# EAGLE schematic Schaltplan (EAGLE 7.7.0)

## Sheet 1 of 2: SACU
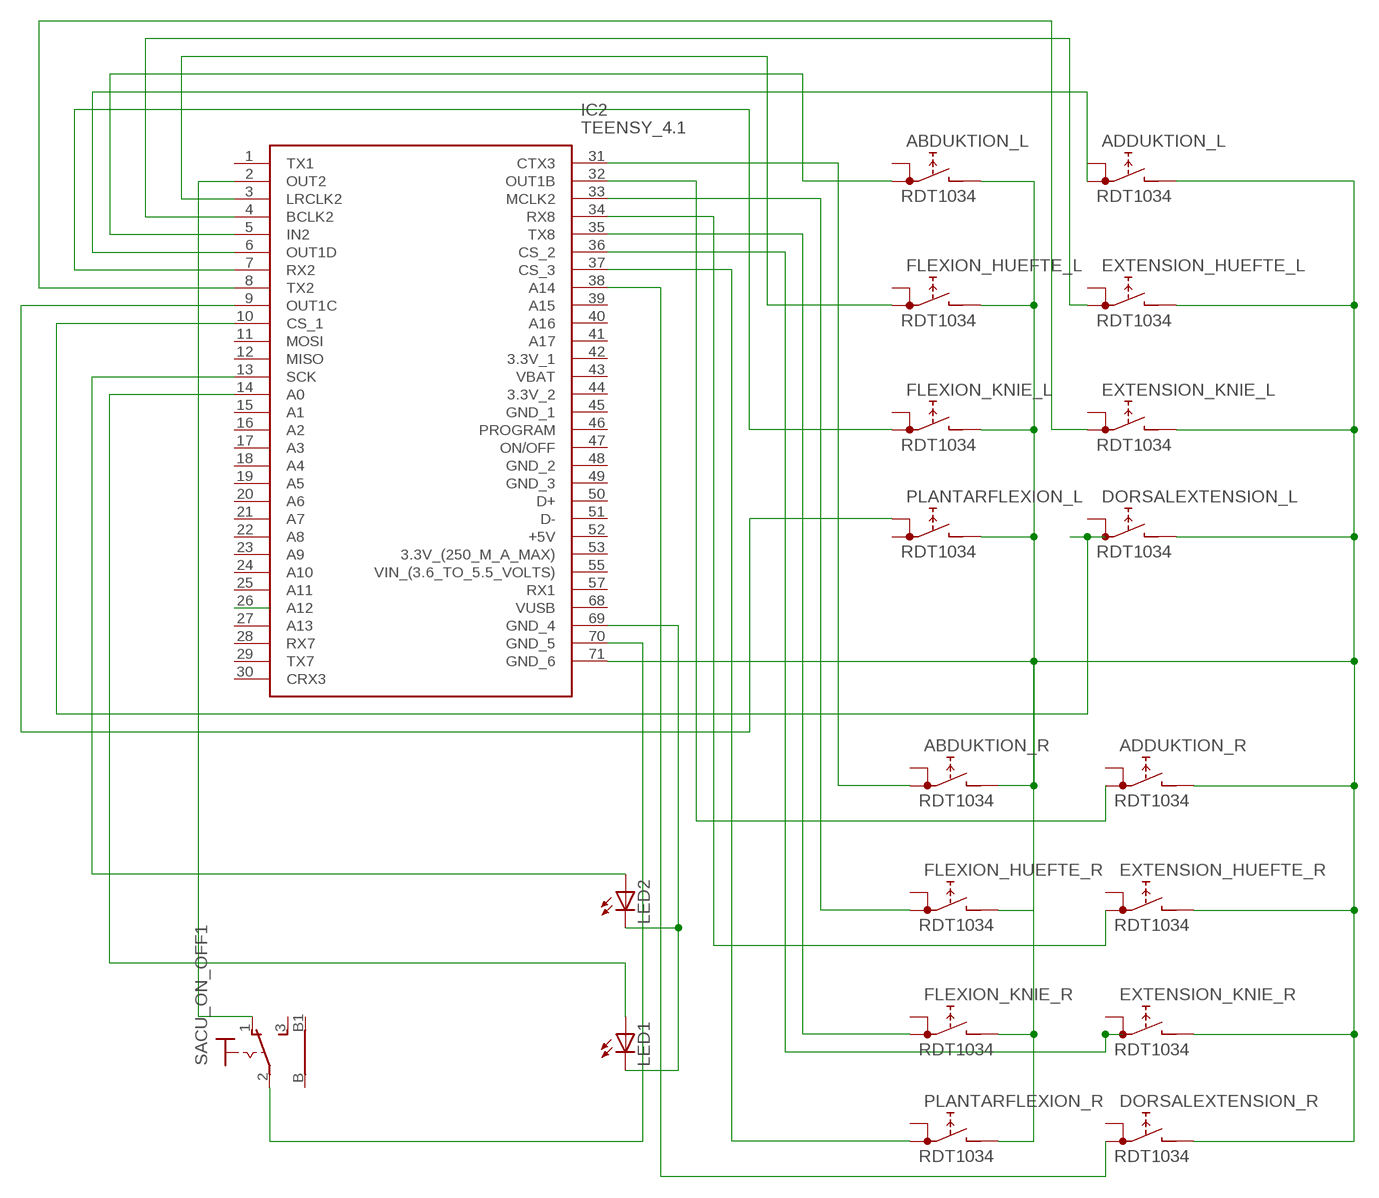
[diagram p0: schematic, sheet 1]

### Parts
ABDUKTION_L  RDT1034  [RDT1034]
ABDUKTION_R  RDT1034  [RDT1034]
ADDUKTION_L  RDT1034  [RDT1034]
ADDUKTION_R  RDT1034  [RDT1034]
DORSALEXTENSION_L  RDT1034  [RDT1034]
DORSALEXTENSION_R  RDT1034  [RDT1034]
EXTENSION_HUEFTE_L  RDT1034  [RDT1034]
EXTENSION_HUEFTE_R  RDT1034  [RDT1034]
EXTENSION_KNIE_L  RDT1034  [RDT1034]
EXTENSION_KNIE_R  RDT1034  [RDT1034]
FLEXION_HUEFTE_L  RDT1034  [RDT1034]
FLEXION_HUEFTE_R  RDT1034  [RDT1034]
FLEXION_KNIE_L  RDT1034  [RDT1034]
FLEXION_KNIE_R  RDT1034  [RDT1034]
IC2  TEENSY_4.1  [TEENSY41]
LED1  LED10MM  [LED10MM]
LED2  LED10MM  [LED10MM]
PLANTARFLEXION_L  RDT1034  [RDT1034]
PLANTARFLEXION_R  RDT1034  [RDT1034]
SACU_ON_OFF1  316-917  [316-917]

### Nets
N$2: ABDUKTION_L.B ABDUKTION_R.B ADDUKTION_L.B ADDUKTION_R.B DORSALEXTENSION_L.B DORSALEXTENSION_R.B EXTENSION_HUEFTE_L.B EXTENSION_HUEFTE_R.B EXTENSION_KNIE_L.B EXTENSION_KNIE_R.B FLEXION_HUEFTE_L.B FLEXION_HUEFTE_R.B FLEXION_KNIE_L.B FLEXION_KNIE_R.B IC2.71(GND_6) PLANTARFLEXION_L.B PLANTARFLEXION_R.B
N$14: IC2.26(A12)
N$15: IC2.2(OUT2) SACU_ON_OFF1.1(O)
N$20: EXTENSION_KNIE_R.A1 IC2.36(CS_2)
N$26: FLEXION_HUEFTE_L.A1 IC2.3(LRCLK2)
N$28: EXTENSION_HUEFTE_L.A1 IC2.4(BCLK2)
N$30: ABDUKTION_L.A1 IC2.5(IN2)
N$31: ADDUKTION_L.A1 IC2.6(OUT1D)
N$32: FLEXION_KNIE_L.A1 IC2.7(RX2)
N$33: EXTENSION_KNIE_L.A1 IC2.8(TX2)
N$34: IC2.9(OUT1C) PLANTARFLEXION_L.A
N$35: IC2.70(GND_5) SACU_ON_OFF1.2(P)
N$36: IC2.13(SCK) LED2.A
N$37: IC2.69(GND_4) LED1.K(C) LED2.K(C)
N$38: ADDUKTION_R.A1 IC2.32(OUT1B)
N$39: IC2.14(A0) LED1.A
N$40: ABDUKTION_R.A1 IC2.31(CTX3)
N$41: FLEXION_HUEFTE_R.A1 IC2.33(MCLK2)
N$42: EXTENSION_HUEFTE_R.A1 IC2.34(RX8)
N$43: FLEXION_KNIE_R.A1 IC2.35(TX8)
N$44: IC2.37(CS_3) PLANTARFLEXION_R.A1
N$45: DORSALEXTENSION_R.A1 IC2.38(A14)
N$46: IC2.10(CS_1)
Unconnected: ABDUKTION_L.A ABDUKTION_R.A ADDUKTION_L.A ADDUKTION_R.A DORSALEXTENSION_L.A DORSALEXTENSION_L.A1 DORSALEXTENSION_R.A EXTENSION_HUEFTE_L.A EXTENSION_HUEFTE_R.A EXTENSION_KNIE_L.A EXTENSION_KNIE_R.A FLEXION_HUEFTE_L.A FLEXION_HUEFTE_R.A FLEXION_KNIE_L.A FLEXION_KNIE_R.A IC2.1(TX1) IC2.11(MOSI) IC2.12(MISO) IC2.15(A1) IC2.16(A2) IC2.17(A3) IC2.18(A4) IC2.19(A5) IC2.20(A6) IC2.21(A7) IC2.22(A8) IC2.23(A9) IC2.24(A10) IC2.25(A11) IC2.27(A13) IC2.28(RX7) IC2.29(TX7) IC2.30(CRX3) IC2.39(A15) IC2.40(A16) IC2.41(A17) IC2.42(3.3V_1) IC2.43(VBAT) IC2.44(3.3V_2) IC2.45(GND_1) IC2.46(PROGRAM) IC2.47(ON/OFF) IC2.48(GND_2) IC2.49(GND_3) IC2.50(D+) IC2.51(D-) IC2.52(+5V) IC2.53(3.3V_(250_M_A_MAX)) IC2.55(VIN_(3.6_TO_5.5_VOLTS)) IC2.57(RX1) IC2.68(VUSB) PLANTARFLEXION_L.A1 PLANTARFLEXION_R.A SACU_ON_OFF1.3(S) SACU_ON_OFF1.B SACU_ON_OFF1.B1

## Sheet 2 of 2: MAIN UI
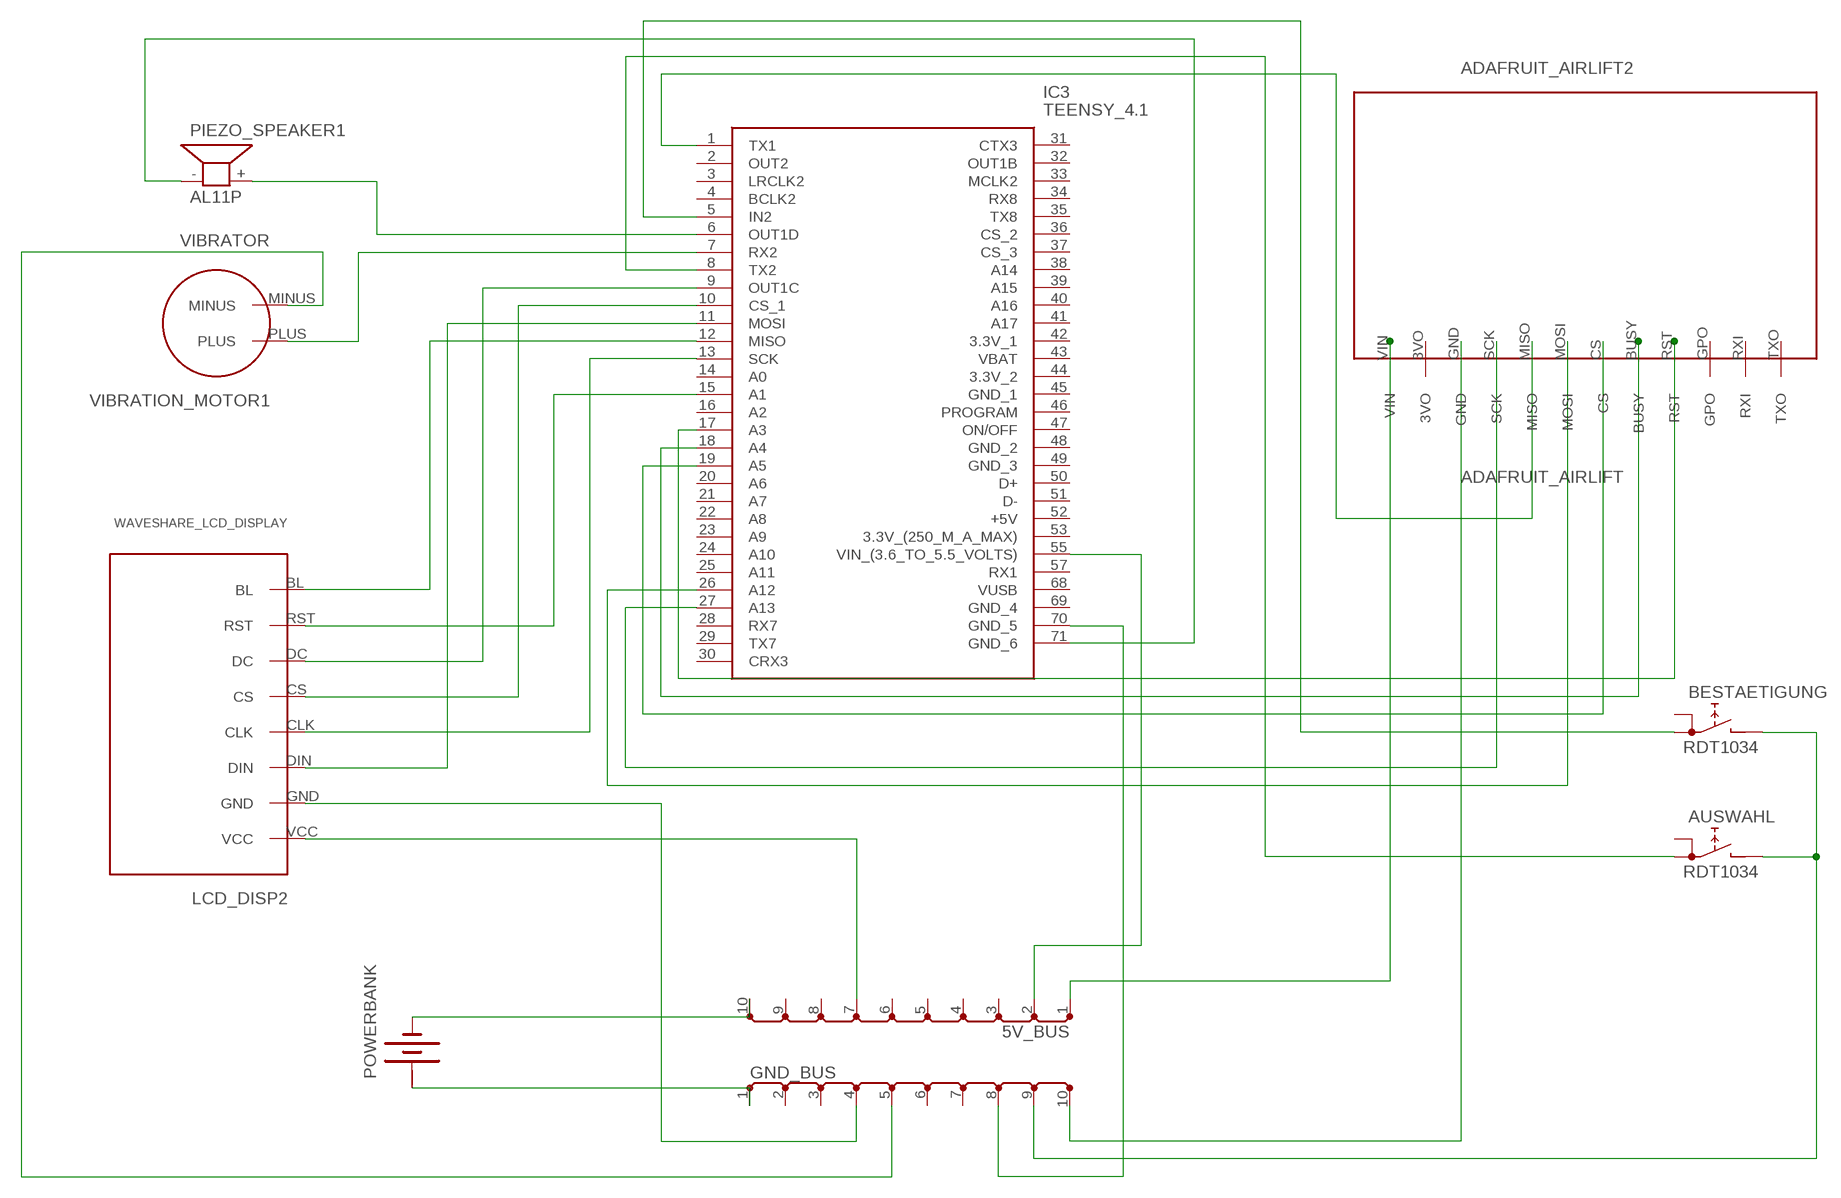
[diagram p1: schematic, sheet 2]

### Parts
5V_BUS  TE4/10  [TE4/10]
ADAFRUIT_AIRLIFT2  ADAFRUIT_AIRLIFT  [ADAFRUIT_AIRLIFT]
AUSWAHL  RDT1034  [RDT1034]
BESTAETIGUNG  RDT1034  [RDT1034]
GND_BUS  TE4/10  [TE4/10]
IC3  TEENSY_4.1  [TEENSY41]
LCD_DISP2  WAVESHARE_LCD_DISPLAY  [WAVESHARE_LCD_DISPLAY]
PIEZO_SPEAKER1  AL11P  [AL11P]
POWERBANK  BATTERY  [BATTERY]
VIBRATION_MOTOR1  VIBRATOR  [VIBRATOR]

### Nets
5V: 5V_BUS.2(P) IC3.55(VIN_(3.6_TO_5.5_VOLTS))
GND: GND_BUS.4(P) LCD_DISP2.GND
N$1: 5V_BUS.7(P) LCD_DISP2.VCC
N$3: ADAFRUIT_AIRLIFT2.CS IC3.19(A5)
N$4: IC3.15(A1) LCD_DISP2.RST
N$5: ADAFRUIT_AIRLIFT2.BUSY IC3.18(A4)
N$6: ADAFRUIT_AIRLIFT2.RST IC3.17(A3)
N$7: IC3.71(GND_6) PIEZO_SPEAKER1.-
N$8: IC3.10(CS_1) LCD_DISP2.CS
N$9: 5V_BUS.1(P) ADAFRUIT_AIRLIFT2.VIN
N$10: IC3.9(OUT1C) LCD_DISP2.DC
N$11: IC3.13(SCK) LCD_DISP2.CLK
N$12: ADAFRUIT_AIRLIFT2.GND GND_BUS.10(P)
N$13: IC3.11(MOSI) LCD_DISP2.DIN
N$16: IC3.12(MISO) LCD_DISP2.BL
N$17: GND_BUS.5(P) VIBRATION_MOTOR1.MINUS
N$18: IC3.7(RX2) VIBRATION_MOTOR1.PLUS
N$19: IC3.6(OUT1D) PIEZO_SPEAKER1.+
N$21: AUSWAHL.A1 IC3.8(TX2)
N$22: BESTAETIGUNG.A1 IC3.5(IN2)
N$23: AUSWAHL.B BESTAETIGUNG.B GND_BUS.9(P)
N$24: ADAFRUIT_AIRLIFT2.SCK IC3.27(A13)
N$25: ADAFRUIT_AIRLIFT2.MOSI IC3.26(A12)
N$27: ADAFRUIT_AIRLIFT2.MISO IC3.1(TX1)
N$29: GND_BUS.8(P) IC3.70(GND_5)
N$47: 5V_BUS.10(P) POWERBANK.-
N$48: GND_BUS.1(P) POWERBANK.+
Unconnected: 5V_BUS.3(P) 5V_BUS.4(P) 5V_BUS.5(P) 5V_BUS.6(P) 5V_BUS.8(P) 5V_BUS.9(P) ADAFRUIT_AIRLIFT2.3VO ADAFRUIT_AIRLIFT2.GPO ADAFRUIT_AIRLIFT2.RXI ADAFRUIT_AIRLIFT2.TXO AUSWAHL.A BESTAETIGUNG.A GND_BUS.2(P) GND_BUS.3(P) GND_BUS.6(P) GND_BUS.7(P) IC3.2(OUT2) IC3.3(LRCLK2) IC3.4(BCLK2) IC3.14(A0) IC3.16(A2) IC3.20(A6) IC3.21(A7) IC3.22(A8) IC3.23(A9) IC3.24(A10) IC3.25(A11) IC3.28(RX7) IC3.29(TX7) IC3.30(CRX3) IC3.31(CTX3) IC3.32(OUT1B) IC3.33(MCLK2) IC3.34(RX8) IC3.35(TX8) IC3.36(CS_2) IC3.37(CS_3) IC3.38(A14) IC3.39(A15) IC3.40(A16) IC3.41(A17) IC3.42(3.3V_1) IC3.43(VBAT) IC3.44(3.3V_2) IC3.45(GND_1) IC3.46(PROGRAM) IC3.47(ON/OFF) IC3.48(GND_2) IC3.49(GND_3) IC3.50(D+) IC3.51(D-) IC3.52(+5V) IC3.53(3.3V_(250_M_A_MAX)) IC3.57(RX1) IC3.68(VUSB) IC3.69(GND_4)

## Power pins joined to a net without a drawn wire
+: POWERBANK.+@1(+)

## Library data of the parts
5V_BUS GND_BUS = busbar:TE4/10: BUS BAR 10 connections, grid 4 TE
ABDUKTION_L ABDUKTION_R ADDUKTION_L ADDUKTION_R AUSWAHL BESTAETIGUNG DORSALEXTENSION_L DORSALEXTENSION_R EXTENSION_HUEFTE_L EXTENSION_HUEFTE_R EXTENSION_KNIE_L EXTENSION_KNIE_R FLEXION_HUEFTE_L FLEXION_HUEFTE_R FLEXION_KNIE_L FLEXION_KNIE_R PLANTARFLEXION_L PLANTARFLEXION_R = switch:RDT1034: PUSH SWITCH www.radiohm.com
ADAFRUIT_AIRLIFT2 = Wifi_Module:ADAFRUIT_AIRLIFT
IC2 IC3 = TEENSY_4.1:TEENSY_4.1: Teensy 4.1 Development Board Source: Datasheet <https://www.pjrc.com/store/teensy41.html>; DESCRIPTION: Teensy 4.1 Development Board; HEIGHT: mm; MANUFACTURER_NAME: PJRC; MANUFACTURER_PART_NUMBER: TEENSY 4.1
LCD_DISP2 = display:WAVESHARE_LCD_DISPLAY
LED1 LED2 = led:LED: LED OSRAM: - CHIPLED LG R971, LG N971, LY N971, LG Q971, LY Q971, LO R971, LY R971 LH N974, LH R974 LS Q976, LO Q976, LY Q976 LO Q996 - Hyper CHIPLED LW Q18S LB Q993, LB Q99A, LB R99A - SideLED LS A670, LO A670, LY A670, LG A670, LP A670 LB A673, LV A673, LT A673, LW A673 LH A674 LY A675 LS A676, LA A676, LO A676, LY A676, LW A676 LS A679, LY A679, LG A679 - Hyper Micro SIDELED® LS Y876, LA Y876, LO Y876, LY Y876 LT Y87S - SmartLED LW L88C, LW L88S LB L89C, LB L89S, LG L890 LS L89K, LO L89K, LY L89K LS L896, LA L896, LO L896, LY L896 - TOPLED LS T670, LO T670, LY T670, LG T670, LP T670 LSG T670, LSP T670, LSY T670, LOP T670, LYG T670 LG T671, LOG T671, LSG T671 LB T673, LV T673, LT T673, LW T673 LH T674 LS T676, LA T676, LO T676, LY T676, LB T676, LH T676, LSB T676, LW T676 LB T67C, LV T67C, LT T67C, LS T67K, LO T67K, LY T67K, LW E67C LS E67B, LA E67B, LO E67B, LY E67B, LB E67C, LV E67C, LT E67C LW T67C LS T679, LY T679, LG T679 LS T770, LO T770, LY T770, LG T770, LP T770 LB T773, LV T773, LT T773, LW T773 LH T774 LS E675, LA E675, LY E675, LS T675 LS T776, LA T776, LO T776, LY T776, LB T776 LHGB T686 LT T68C, LB T68C - Hyper Mini TOPLED® LB M676 - Mini TOPLED Santana® LG M470 LS M47K, LO M47K, LY M47K Source: http://www.osram.convergy.de LUXEON: - LUMILED® LXK2-PW12-R00, LXK2-PW12-S00, LXK2-PW14-U00, LXK2-PW14-V00 LXK2-PM12-R00, LXK2-PM12-S00, LXK2-PM14-U00 LXK2-PE12-Q00, LXK2-PE12-R00, LXK2-PE12-S00, LXK2-PE14-T00, LXK2-PE14-U00 LXK2-PB12-K00, LXK2-PB12-L00, LXK2-PB12-M00, LXK2-PB14-N00, LXK2-PB14-P00, LXK2-PB14-Q00 LXK2-PR12-L00, LXK2-PR12-M00, LXK2-PR14-Q00, LXK2-PR14-R00 LXK2-PD12-Q00, LXK2-PD12-R00, LXK2-PD12-S00 LXK2-PH12-R00, LXK2-PH12-S00 LXK2-PL12-P00, LXK2-PL12-Q00, LXK2-PL12-R00 Source: www.luxeon.com KINGBRIGHT: KA-3528ASYC Source: www.kingbright.com
PIEZO_SPEAKER1 = buzzer:AL11P: SPEAKER Source: Buerklin; OC_FARNELL: unknown; OC_NEWARK: unknown
POWERBANK = special:BATTERY: BATTERY
SACU_ON_OFF1 = switch:316-917: TOGGLE SWITCH Mors, distributor RS Components
VIBRATION_MOTOR1 = Vibration:VIBRATOR